# Altium project hardware-based_line_follower.PrjPcb
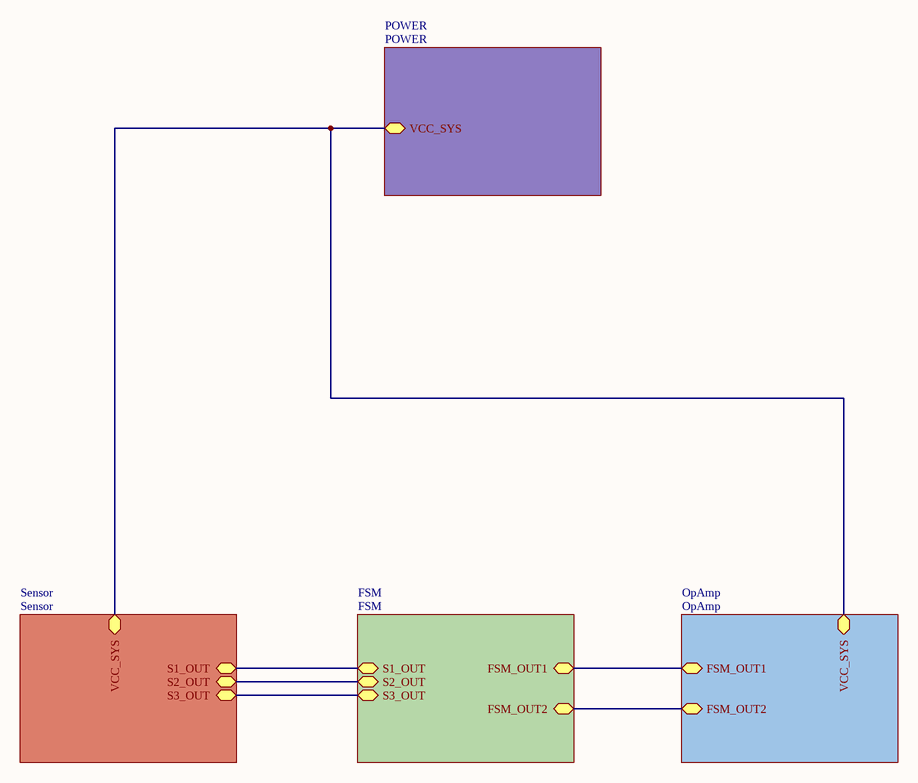
[diagram p0: Overview.SchDoc]
5 sheets, 49 parts. Net scope: hierarchical (ports join the sheet entries above them; power ports are global).
Board file: PCB1.PcbDoc
Sheets:
  Overview.SchDoc
    Sensor = Sensor.SchDoc
    FSM = FSM.SchDoc
    OpAmp = OpAmp.SchDoc
    POWER = POWER.SchDoc

## Sheet Overview.SchDoc
size A4; SheetNumber: 1; SheetTotal: 5

### Sub-sheets
FSM = FSM: S1_OUT (bidir), S2_OUT (bidir), FSM_OUT1 (bidir), FSM_OUT2 (bidir), S3_OUT (bidir)
OpAmp = OpAmp: FSM_OUT1 (bidir), FSM_OUT2 (bidir), VCC_SYS (bidir)
POWER = POWER: VCC_SYS (bidir)
Sensor = Sensor: S2_OUT (bidir), S1_OUT (bidir), VCC_SYS (bidir), S3_OUT (bidir)

### Nets
VCC_SYS: sheet Sensor/VCC_SYS, sheet OpAmp/VCC_SYS, sheet POWER/VCC_SYS
FSM_OUT1: sheet FSM/FSM_OUT1, sheet OpAmp/FSM_OUT1
FSM_OUT2: sheet FSM/FSM_OUT2, sheet OpAmp/FSM_OUT2
S1_OUT: sheet Sensor/S1_OUT, sheet FSM/S1_OUT
S2_OUT: sheet Sensor/S2_OUT, sheet FSM/S2_OUT
S3_OUT: sheet Sensor/S3_OUT, sheet FSM/S3_OUT

## Sheet Sensor.SchDoc
size A4; SheetNumber: 5; SheetTotal: 5
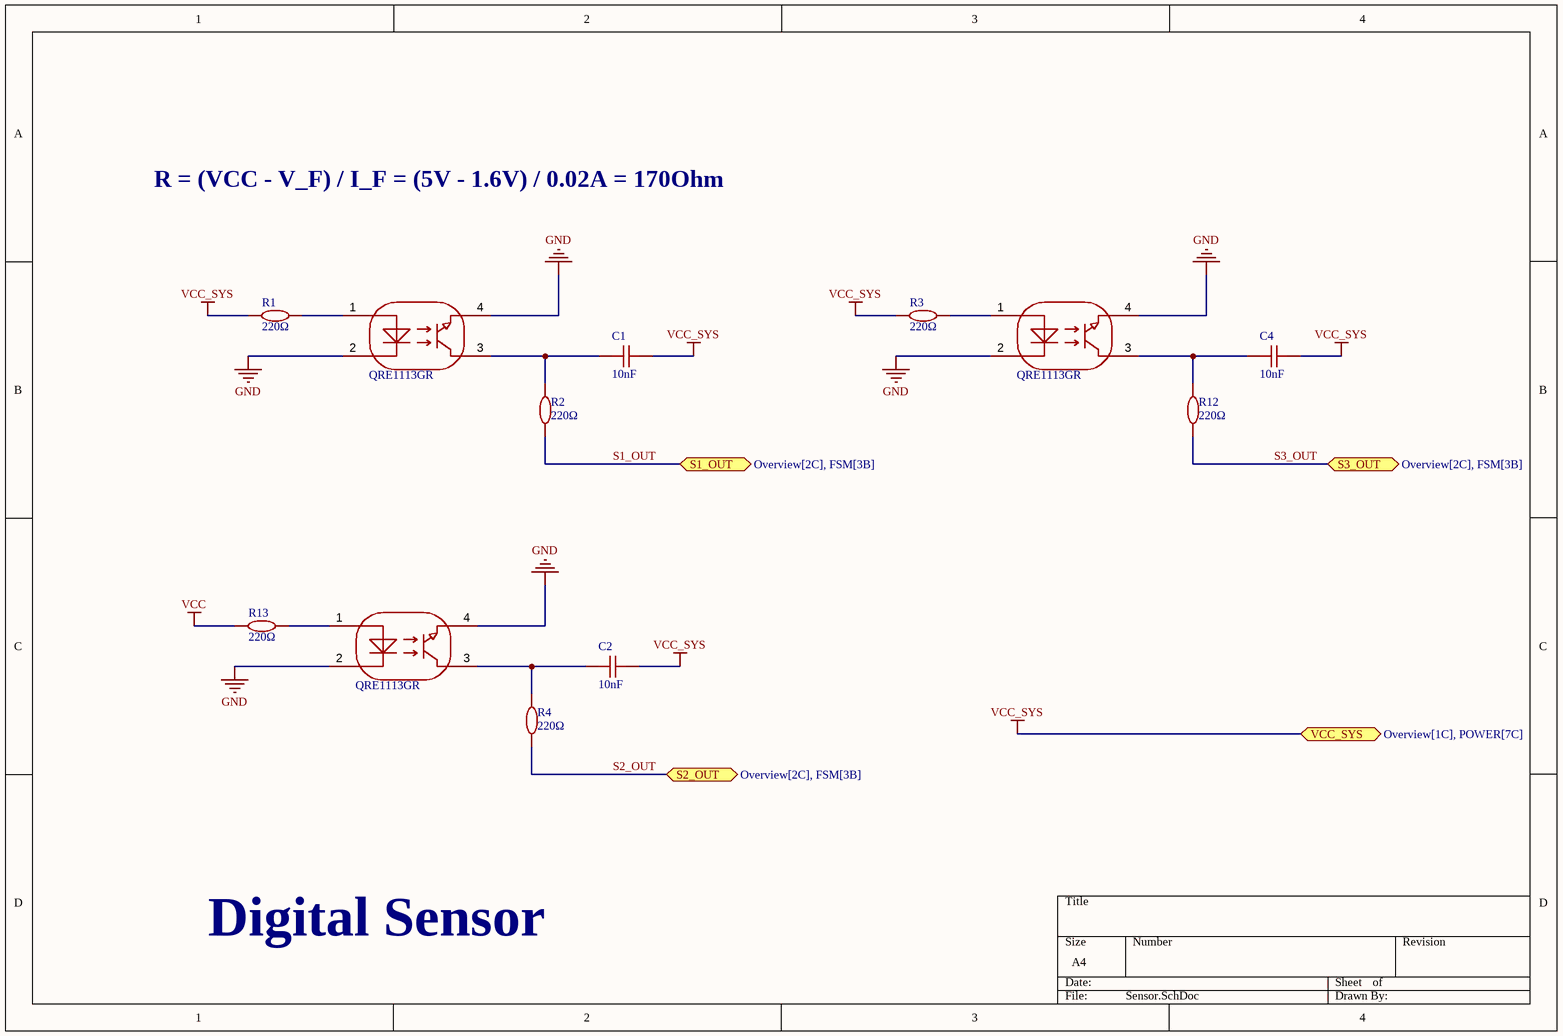
[diagram p1: Sensor.SchDoc]

### Parts
C1  10nF  [C0402]
C2  10nF  [C0402]
C4  10nF  [C0402]
R1  220Ω  [R0402]
R2  220Ω  [R0402]
R3  220Ω  [R0402]
R4  220Ω  [R0402]
R12  220Ω  [R0402]
R13  220Ω  [R0402]
U1  QRE1113GR  [OPTO-SMD_QRE1113GR]
U2  QRE1113GR  [OPTO-SMD_QRE1113GR]
U3  QRE1113GR  [OPTO-SMD_QRE1113GR]

### Ports
S1_OUT (bidir, see Overview[2C], FSM[3B]), S2_OUT (bidir, see Overview[2C], FSM[3B]), S3_OUT (bidir, see Overview[2C], FSM[3B]), VCC_SYS (bidir, see Overview[1C], POWER[7C])

### Nets
GND: U1.2 U1.4 U2.2 U2.4 U3.2 U3.4
VCC: R13.2
VCC_SYS: C1.2 C2.2 C4.2 R1.2 R3.2 ; port VCC_SYS
S1_OUT: R2.1 ; port S1_OUT
S2_OUT: R4.1 ; port S2_OUT
S3_OUT: R12.1 ; port S3_OUT
NetC1_1: C1.1 R2.2 U1.3
NetC2_1: C2.1 R4.2 U2.3
NetC4_1: C4.1 R12.2 U3.3
NetR1_1: R1.1 U1.1
NetR3_1: R3.1 U3.1
NetR13_1: R13.1 U2.1

### Notes on the sheet
- R = (VCC - V_F) / I_F = (5V - 1.6V) / 0.02A = 170Ohm
- Digital Sensor

### Library data of the parts
C1 C2 C4 = 10nF: 50V 10nF X7R ±10% 0402 Ceramic Capacitors ROHS
R1 R3 R13 = 100Ω: 100Ω 62.5mW 50V ±100ppm/℃ Thick Film Resistor ±1% 0402 Chip Resistor - Surface Mount ROHS
R2 R4 R12 = 220Ω: 小尺寸、重量轻。降低组装成本,与贴片机匹配。适用于波峰焊和回流焊
U1-U3 = QRE1113GR: QRE1113 由在塑料矩形盒体中与兼容硅光电晶体管并排封装的 940nm 发射极组成。采用表面贴装和通孔选项。; Symbol: QRE1113GR

## Sheet FSM.SchDoc
size A4; SheetNumber: 2; SheetTotal: 5
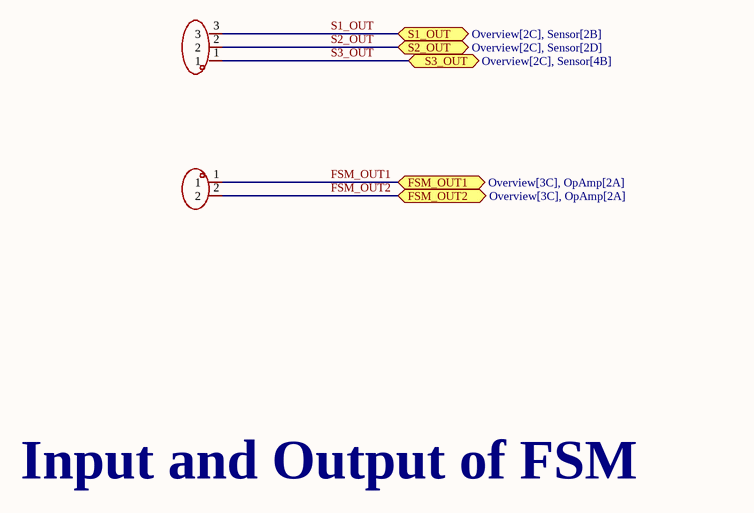
[diagram p2: FSM.SchDoc]

### Parts
H1  HX PZ2.54-1x3P ZZ  [CONN-TH_HX-PZ2.54-1X3P-ZZ]  (value not drawn)
U4  HX PZ2.54-1x2P ZZ  [HDR-TH_2P-P2.54-V-M-3]  (value not drawn)

### Ports
FSM_OUT1 (bidir, see Overview[3C], OpAmp[2A]), FSM_OUT2 (bidir, see Overview[3C], OpAmp[2A]), S1_OUT (bidir, see Overview[2C], Sensor[2B]), S2_OUT (bidir, see Overview[2C], Sensor[2D]), S3_OUT (bidir, see Overview[2C], Sensor[4B])

### Nets
FSM_OUT1: U4.1 ; port FSM_OUT1
FSM_OUT2: U4.2 ; port FSM_OUT2
S1_OUT: H1.3 ; port S1_OUT
S2_OUT: H1.2 ; port S2_OUT
S3_OUT: H1.1 ; port S3_OUT

### Notes on the sheet
- Input and Output of FSM

### Library data of the parts
H1 = HX PZ2.54-1x3P ZZ: 3P 1x3P Gold Brass -40℃~+105℃ Black Pin Header 2.54mm 2.5mm 6mm 1kV 3mm 3A 1 Through Hole Through Hole,P=2.54mm Headers, Male Pins ROHS; Manufacturer: hanxia(韩下); Add into BOM: yes; Symbol: HX PZ2.54-1X3P ZZ; Device: HX PZ2.54-1x3P ZZ; LCSC Part Name: 1x3P 间距:2.54mm 方针 直插; Supplier Part: C32713269; Manufacturer Part: HX PZ2.54-1x3P ZZ; Supplier Footprint: 插件,P=2.54mm; JLCPCB Part Class: Extended Part; Datasheet: https://item.szlcsc.com/datasheet/HX%2520PZ2.54-1x3P%2520ZZ/34444549.html; Supplier: LCSC; Convert to PCB: yes; Pin Structure: 1x3P; Pitch: 2.54mm; Row Spacing: -; Circluar Pins/Square Pins: Pin Header; Mounting Type: Through Hole; Number of Rows: 1; Number of Pins: 3P; Current Rating: 3A; Voltage Rating (Max): 1kV; Length of Mating Pin: 6mm; Insulation Height: 2.5mm; Length of End Connection Pin: 3mm; Contact Material: Brass; Contact Plating: Gold; Operating Temperature: -40℃~+105℃; Color: Black; Supplementary Features: -
U4 = HX PZ2.54-1x2P ZZ: Manufacturer: hanxia(韩下); Add into BOM: yes; Pin Structure: 1x2P; Pitch: 2.54mm; Circluar Pins/Square Pins: Pin Header; Current Rating: 3A; Symbol: HX PZ2.54-1X2P ZZ; Device: HX PZ2.54-1x2P ZZ; LCSC Part Name: 1x2P 间距:2.54mm 方针 直插; Supplier Part: C32713268; Manufacturer Part: HX PZ2.54-1x2P ZZ; Supplier Footprint: 插件,P=2.54mm; JLCPCB Part Class: Extended Part; Datasheet: https://item.szlcsc.com/datasheet/HX%2520PZ2.54-1x2P%2520ZZ/34444548.html; Supplier: LCSC; Convert to PCB: yes; Row Spacing: -; Mounting Type: Through Hole; Number of Rows: 1; Number of Pins: 2P; Voltage Rating (Max): -; Length of Mating Pin: 6mm; Insulation Height: 2.5mm; Length of End Connection Pin: 3mm; Contact Material: Brass; Contact Plating: Gold; Operating Temperature: -40℃~+105℃; Color: Black

## Sheet OpAmp.SchDoc
size A4; SheetNumber: 3; SheetTotal: 5
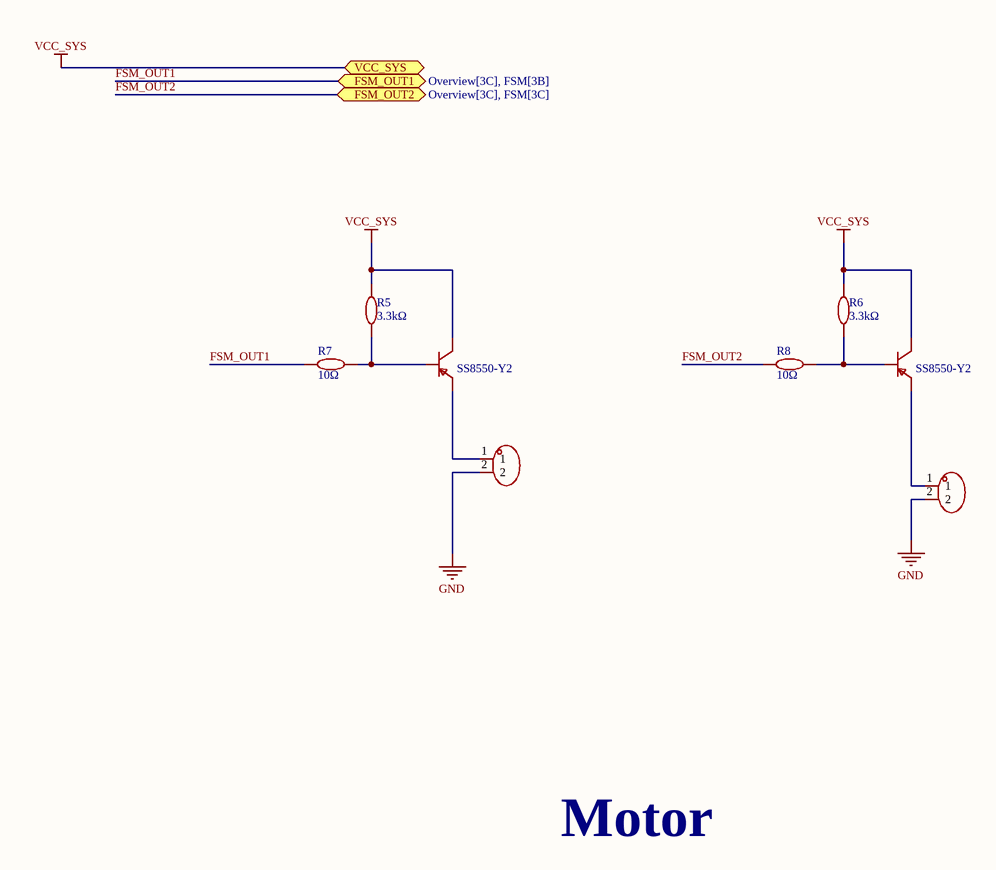
[diagram p3: OpAmp.SchDoc]

### Parts
Q1  SS8550-Y2  [SOT-23_L2.9-W1.3-P1.90-LS2.4-BR]
Q2  SS8550-Y2  [SOT-23_L2.9-W1.3-P1.90-LS2.4-BR]
R5  3.3kΩ  [R0402]
R6  3.3kΩ  [R0402]
R7  10Ω  [R0402]
R8  10Ω  [R0402]
U7  WJ500V-5.08-2P-13-00A  [CONN-TH_DB125-2.54-2P-GN]  (value not drawn)
U8  WJ500V-5.08-2P-13-00A  [CONN-TH_DB125-2.54-2P-GN]  (value not drawn)

### Ports
FSM_OUT1 (bidir, see Overview[3C], FSM[3B]), FSM_OUT2 (bidir, see Overview[3C], FSM[3C]), VCC_SYS (bidir)

### Nets
GND: U7.2 U8.2
VCC_SYS: Q1.3(C) Q2.3(C) R5.2 R6.2 ; port VCC_SYS
FSM_OUT1: R7.1 ; port FSM_OUT1
FSM_OUT2: R8.1 ; port FSM_OUT2
NetQ1_1: Q1.1(B) R5.1 R7.2
NetQ1_2: Q1.2(E) U7.1
NetQ2_1: Q2.1(B) R6.1 R8.2
NetQ2_2: Q2.2(E) U8.1

### Notes on the sheet
- Motor

### Library data of the parts
Q1 Q2 = SS8550-Y2: H档200-350 PNP 电流:1.5A 电压:25V 该 PNP 双极晶体管适用于线性和开关应用。此器件采用 SOT-23 封装，适用于低功率表面贴装应用。; Symbol: SS8550-Y2
R5 R6 = 3.3kΩ: 62.5mW 3.3kΩ 50V ±100ppm/℃ Thick Film Resistor ±1% 0402 Chip Resistor - Surface Mount ROHS
R7 R8 = 10Ω: 10Ω 62.5mW 50V ±200ppm/℃ Thick Film Resistor ±1% 0402 Chip Resistor - Surface Mount ROHS
U7 U8 = DORABO DB125-2.54-2P-GN-S: 2.54 srew terminal; Manufacturer: KANGNEX(康奈克斯电气); Add into BOM: yes; Symbol: WJ500V-5.08-2P-13-00A; Device: WJ500V-5.08-2P-13-00A; LCSC Part Name: 直插  P=5.08mm 2P 可拼接 黑色; Supplier Part: C42377752; Manufacturer Part: WJ500V-5.08-2P-13-00A; Supplier Footprint: 插件,P=5.08mm; JLCPCB Part Class: Extended Part; Datasheet: https://atta.szlcsc.com/upload/public/pdf/source/20241106/B65BE8431F64096104C016AC2C83CE18.pdf; Supplier: LCSC; Convert to PCB: yes

## Sheet POWER.SchDoc
size A3; SheetNumber: 4; SheetTotal: 5
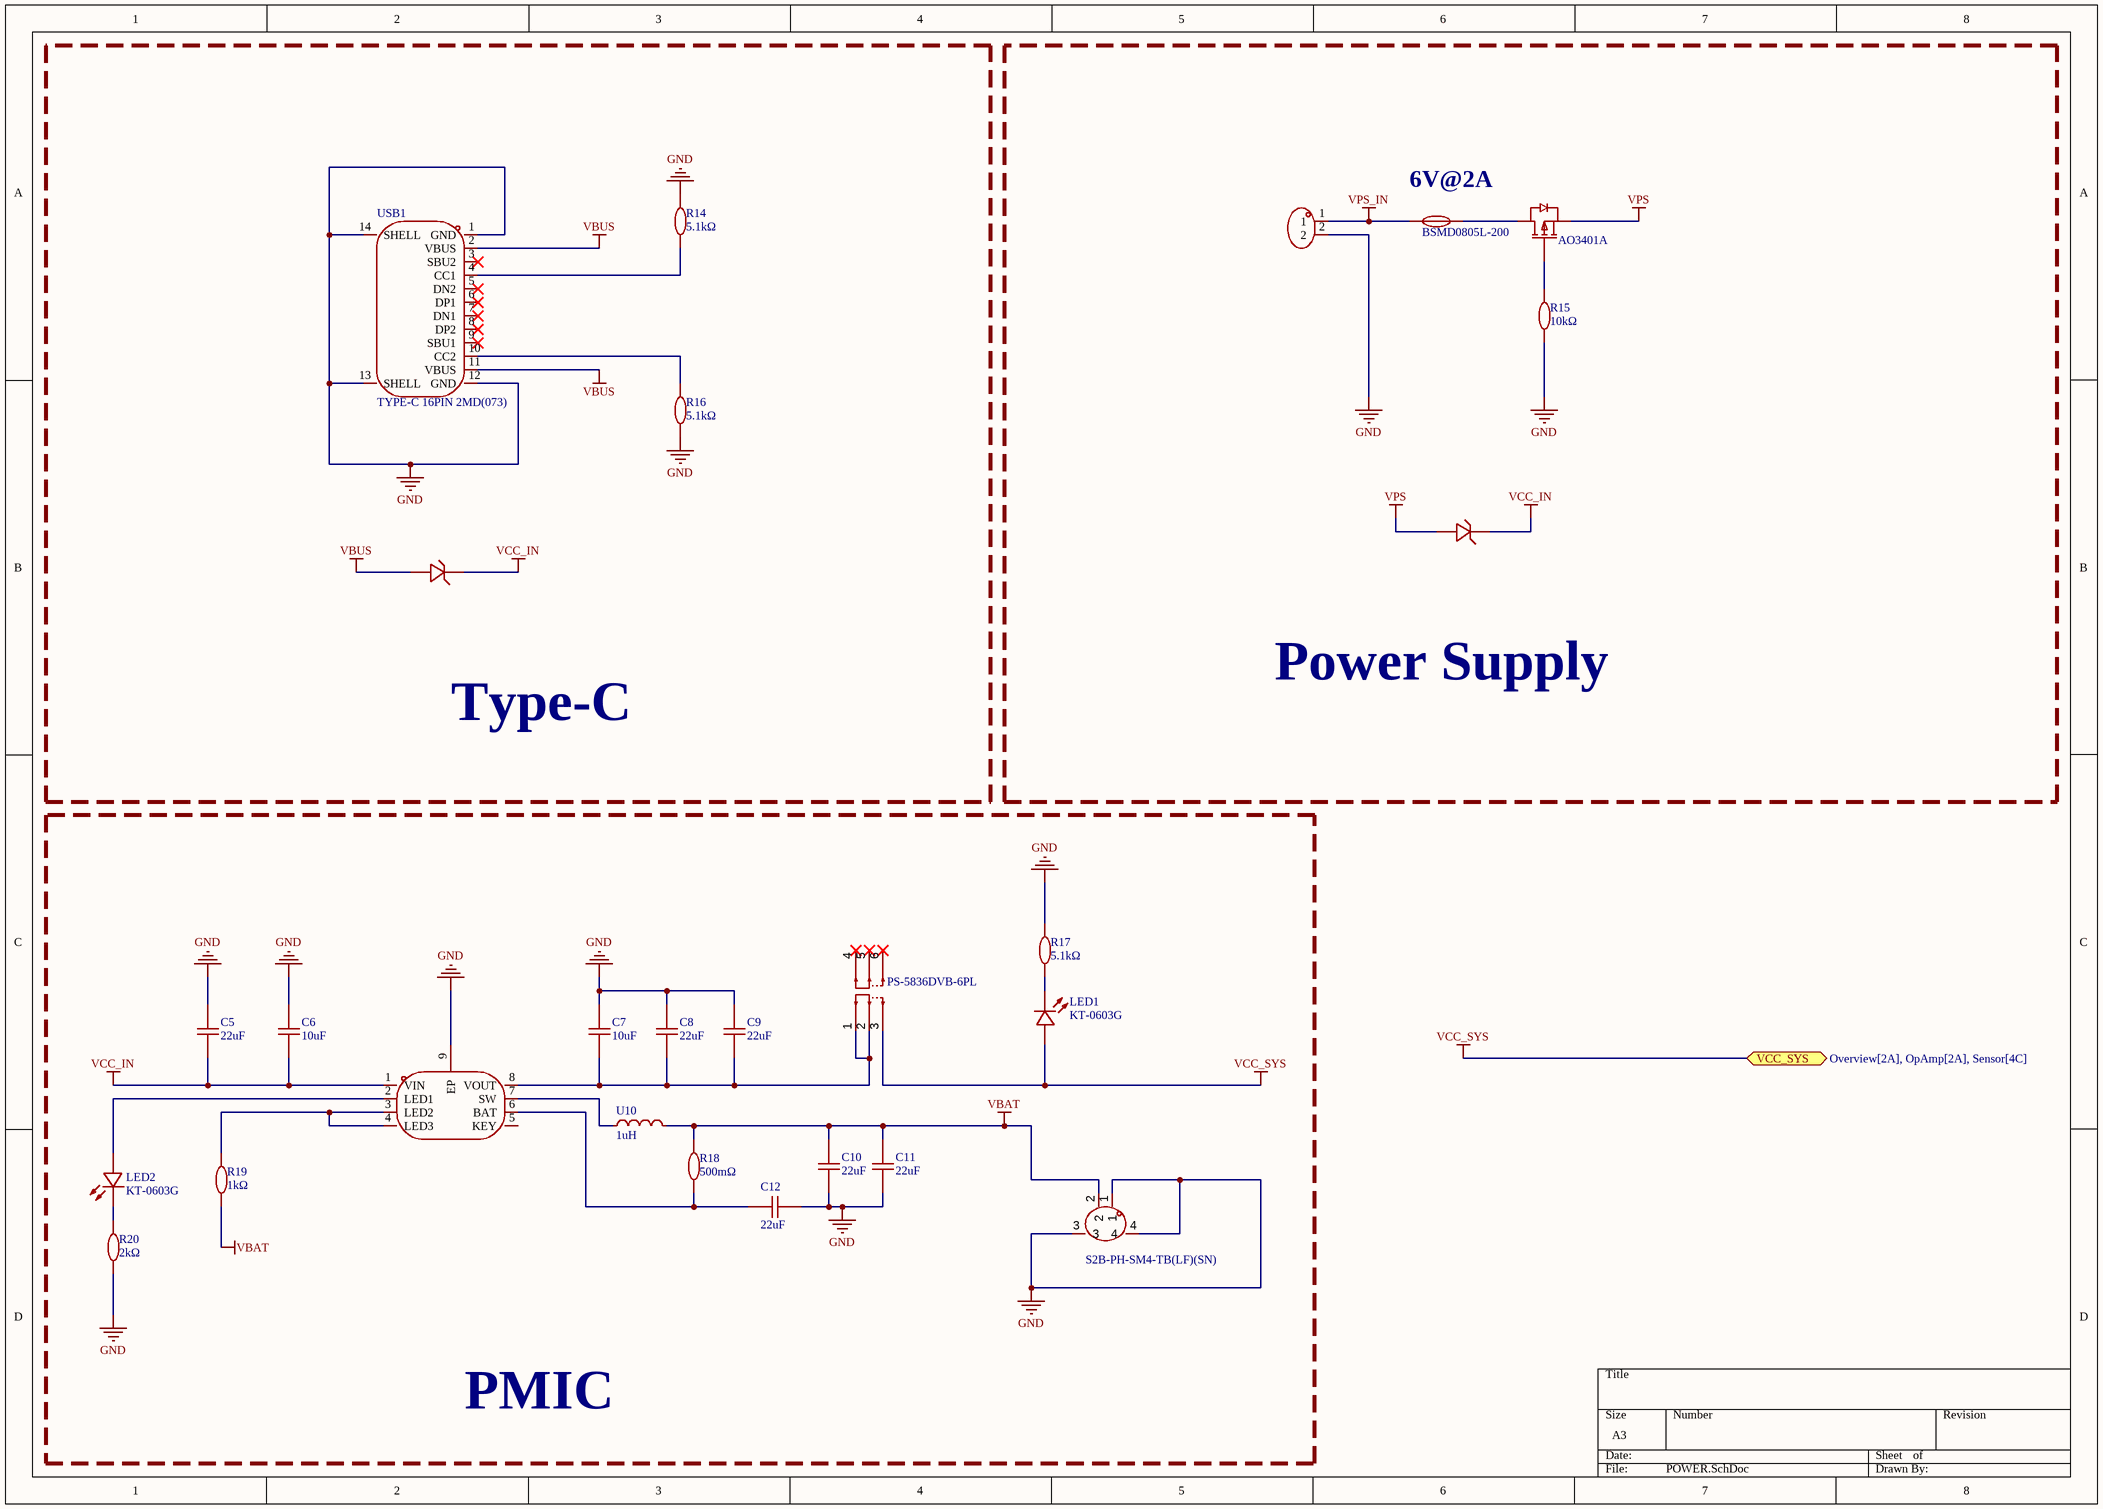
[diagram p4: POWER.SchDoc]

### Parts
C5  22uF  [C0603]
C6  10uF  [C0603]
C7  10uF  [C0603]
C8  22uF  [C0603]
C9  22uF  [C0603]
C10  22uF  [C0603]
C11  22uF  [C0603]
C12  22uF  [C0603]
CN1  S2B-PH-SM4-TB(LF)(SN)  [CONN-SMD_P2.00_S2B-PH-SM4-TB-LF-SN]
D1  DSK24  [SOD-123FL_L2.7-W1.8-LS3.8-RD]  (value not drawn)
D2  DSK24  [SOD-123FL_L2.7-W1.8-LS3.8-RD]  (value not drawn)
F1  BSMD0805L-200  [F0805]
LED1  KT-0603G  [LED0603-GR]
LED2  KT-0603G  [LED0603-GR]
Q3  AO3401A  [SOT-23_L2.9-W1.3-P1.90-LS2.4-BR]
R14  5.1kΩ  [R0402]
R15  10kΩ  [R0402]
R16  5.1kΩ  [R0402]
R17  5.1kΩ  [R0402]
R18  500mΩ  [R0402]
R19  1kΩ  [R0402]
R20  2kΩ  [R0402]
U9  PS-5836DVB-6PL  [SW-TH_6P-L5.8-W5.8-P2.00-LS4.5-BL]
U10  1uH  [IND-SMD_L2.5-W2.0_WPN252012H]
U11  IP5306  [ESOP-8_L4.9-W3.9-P1.27-LS6.0-BL-EP]  (value not drawn)
U?  HX PZ2.54-1x2P ZZ  [HDR-TH_2P-P2.54-V-M-3]  (value not drawn)
USB1  TYPE-C 16PIN 2MD(073)  [USB-C-SMD_TYPE-C-6PIN-2MD-073]

### Blocks framed on the sheet
Type-C: D2 R14 R16 USB1
Power Supply: D1 F1 Q3 R15 U?
PMIC: C5-C12 CN1 LED1 LED2 R17-R20 U9-U11

### Ports
VCC_SYS (bidir, see Overview[2A], OpAmp[2A], Sensor[4C])

### Nets
GND: C5.2 C6.2 C7.2 C8.2 C9.2 C10.1 C11.1 C12.1 CN1.1 CN1.3 CN1.4 R14.2 R15.1 R16.1 R17.2 R20.1 U11.9(EP) U?.2 USB1.1(GND) USB1.12(GND) USB1.13(SHELL) USB1.14(SHELL)
VBAT: C10.2 C11.2 CN1.2 R18.2 R19.1 U10.2
VBUS: D2.2(A) USB1.2(VBUS) USB1.11(VBUS)
VCC_IN: C5.1 C6.1 D1.1(C) D2.1(C) U11.1(VIN)
VCC_SYS: LED1.2(A) U9.3 ; port VCC_SYS
VPS: D1.2(A) Q3.2(S)
VPS_IN: F1.1 U?.1
NetC7_1: C7.1 C8.1 C9.1 U9.1 U9.2 U11.8(VOUT)
NetC12_2: C12.2 R18.1 U11.6(BAT)
NetF1_2: F1.2 Q3.3(D)
NetLED1_1: LED1.1(K) R17.1
NetLED2_1: LED2.1(K) R20.2
NetLED2_2: LED2.2(A) U11.2(LED1)
NetQ3_1: Q3.1(G) R15.2
NetR14_1: R14.1 USB1.4(CC1)
NetR16_2: R16.2 USB1.10(CC2)
NetR19_2: R19.2 U11.3(LED2) U11.4(LED3)
NetU10_1: U10.1 U11.7(SW)

Not connected (* = marked no-connect by the designer): U9 4* 5* 6*; U11 5(KEY); USB1 3(SBU2)* 5(DN2)* 6(DP1)* 7(DN1)* 8(DP2)* 9(SBU1)*

### Notes on the sheet
- (near F1) 6V@2A

### Library data of the parts
C5 C8-C12 = 22uF: 16V 22uF X5R ±20% 0603 Ceramic Capacitors ROHS
C6 C7 = 10uF: 10V 10uF X5R ±10% 0603 Ceramic Capacitors ROHS
CN1 = S2B-PH-SM4-TB(LF)(SN): 1x2P 间距:2mm 卧贴 系列:PH; Symbol: S2B-PH-SM4-TB(LF)(SN)
D1 D2 = DSK24: 电压:40V 电流:2A; Manufacturer: Littelfuse(美国力特); Manufacturer Part: SMAJ5.0A; Symbol: SMAJ5.0A-C83329; Device: SMAJ5.0A_C83329; Add into BOM: yes; Polarity: Unidirectional; Reverse Stand-Off Voltage (Vrwm): 5V; Clamping Voltage: 9.2V; Peak Pulse Current (Ipp): 43.5A; Peak Pulse Power Dissipation (Ppp): 400W; Voltage - Breakdown: 6.4V; Reverse Leakage Current (Ir): 800uA; Type: TVS; LCSC Part Name: 耐压/V 5V-440V 峰值脉冲功率 400W; Supplier Part: C83329; Supplier Footprint: DO-214AC(SMA); JLCPCB Part Class: Extended Part; Datasheet: https://item.szlcsc.com/datasheet/SMAJ5.0A/84493.html; Supplier: LCSC; Convert to PCB: yes; Operating Temperature: -65℃~+150℃
F1 = BSMD0805L-200: 6V 2A 0805自恢复; Symbol: BSMD0805L-200
LED1 LED2 = KT-0603G: Green 0603 LED Indication - Discrete ROHS
Q3 = AO3401A: 1个P沟道 耐压:30V 电流:4A; Symbol: AO3401A
R14 R16 R17 = 5.1kΩ: 5.1kΩ 62.5mW 50V ±100ppm/℃ Thick Film Resistor ±1% 0402 Chip Resistor - Surface Mount ROHS
R15 = 10kΩ: 62.5mW 10kΩ 50V ±100ppm/℃ Thick Film Resistor ±1% 0402 Chip Resistor - Surface Mount ROHS
R18 R19 = 1kΩ: 1kΩ 62.5mW 50V ±100ppm/℃ Thick Film Resistor ±1% 0402 Chip Resistor - Surface Mount ROHS
R20 = 2kΩ: 100mW 2kΩ 75V ±100ppm/℃ Thick Film Resistor ±1% 0402 Chip Resistor - Surface Mount ROHS
U9 = PS-5836DVB-6PL: 高头斜柄自锁,行程1.0mm,按动力250gf; Symbol: PS-5836DVB-6PL
U10 = WPN252012H1R0MT
U11 = IP5306: 集成2.1A充电器和2.1A放电器的全集成移动电源系统级芯片; Manufacturer: INJOINIC(英集芯); Add into BOM: yes; Symbol: IP5306; Device: IP5306; LCSC Part Name: IP5306; Supplier Part: C181692; Manufacturer Part: IP5306; Supplier Footprint: ESOP-8; JLCPCB Part Class: Extended Part; Datasheet: https://atta.szlcsc.com/upload/public/pdf/source/20190627/C384572_9925B3DDC4041BC6108E5AB46A2A0AB1.pdf; Supplier: LCSC; Convert to PCB: yes
U? = HX PZ2.54-1x2P ZZ: as U4 on sheet FSM; Symbol: HX PZ2.54-1X2P ZZ; Device: HX PZ2.54-1x2P ZZ; LCSC Part Name: 1x2P 间距:2.54mm 方针 直插; Supplier Part: C32713268; Manufacturer Part: HX PZ2.54-1x2P ZZ; Supplier Footprint: 插件,P=2.54mm; JLCPCB Part Class: Extended Part; Datasheet: https://item.szlcsc.com/datasheet/HX%2520PZ2.54-1x2P%2520ZZ/34444548.html; Supplier: LCSC; Convert to PCB: yes; Row Spacing: -; Mounting Type: Through Hole; Number of Rows: 1; Number of Pins: 2P; Voltage Rating (Max): -; Length of Mating Pin: 6mm; Insulation Height: 2.5mm; Length of End Connection Pin: 3mm; Contact Material: Brass; Contact Plating: Gold; Operating Temperature: -40℃~+105℃; Color: Black
USB1 = TYPE-C 16PIN 2MD(073): 16pin type-c

## Nets that join several sheets
GND: Sensor (6 pins), OpAmp (U7.2 U8.2), POWER (22 pins)
VCC_SYS: Sensor (5 pins), OpAmp (Q1.3 Q2.3 R5.2 R6.2), POWER (LED1.2 U9.3)
FSM_OUT1: FSM (U4.1), OpAmp (R7.1)
FSM_OUT2: FSM (U4.2), OpAmp (R8.1)
S1_OUT: Sensor (R2.1), FSM (H1.3)
S2_OUT: Sensor (R4.1), FSM (H1.2)
S3_OUT: Sensor (R12.1), FSM (H1.1)